# EAGLE design properjack (EAGLE 9.1.1)
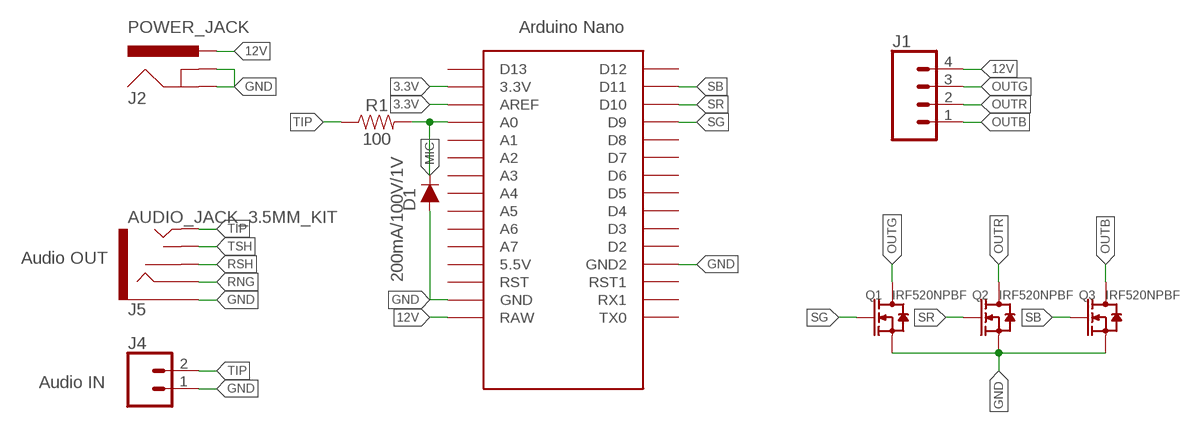
[diagram p0: schematic, sheet 1]

## Parts
D1  200mA/100V/1V  DIODE-1N4148  [DIODE-1N4148]
J1  CONN_04LOCK_LONGPADS  [1X04_LOCK_LONGPADS]
J2  POWER_JACK  [POWER_JACK_PTH]
J4  CONN_02LOCK_LONGPADS  [1X02_LOCK_LONGPADS]
J5  AUDIO_JACK_3.5MM_KIT  [AUDIO-JACK-KIT]
Q1  IRF520NPBF  DIP-MOSFET-N-CH-100V-9.7A-IRF520NPBF(TO-220AB)IRL2703  [TO-220]
Q2  IRF520NPBF  DIP-MOSFET-N-CH-100V-9.7A-IRF520NPBF(TO-220AB)IRL2703  [TO-220]
Q3  IRF520NPBF  DIP-MOSFET-N-CH-100V-9.7A-IRF520NPBF(TO-220AB)IRL2703  [TO-220]
R1  100  100OHM-HORIZ-1/4W-1%  [AXIAL-0.3]
U$1  NANONOICSP  [NANO_2]

## Nets
3.3V: U$1.3.3V U$1.AREF
12V: J1.4 J2.PWR U$1.RAW
GND: D1.A J2.GND J2.GNDBREAK J4.1 J5.SLEEVE Q1.3(S) Q2.3(S) Q3.3(S) U$1.GND U$1.GND1(GND2)
MIC: D1.C R1.P$2 U$1.A0
OUTB: J1.1 Q3.2(D) Q3.HEAT(D)
OUTG: J1.3 Q1.2(D) Q1.HEAT(D)
OUTR: J1.2 Q2.2(D) Q2.HEAT(D)
RNG: J5.RING
RSH: J5.RSH
SB: Q3.1(G) U$1.D11
SG: Q1.1(G) U$1.D9
SR: Q2.1(G) U$1.D10
TIP: J4.2 J5.TIP R1.P$1
TSH: J5.TSH
Unconnected: U$1.5V(5.5V) U$1.A1 U$1.A2 U$1.A3 U$1.A4 U$1.A5 U$1.A6 U$1.A7 U$1.D2 U$1.D3 U$1.D4 U$1.D5 U$1.D6 U$1.D7 U$1.D8 U$1.D12 U$1.D13 U$1.RST U$1.RST1 U$1.RX1 U$1.TX0

## Notes on the sheet
- Audio OUT
- Audio IN

## Library data of the parts
D1 = SparkFun-DiscreteSemi:DIODE: Diode These are standard reverse protection diodes and small signal diodes. SparkFun Products: SparkFun SparkPunk Sound Kit <https://www.sparkfun.com/products/11177> SparkFun ESP8266 Thing <https://www.sparkfun.com/products/13231>; PROD_ID: DIO-08378
J1 = SparkFun-Connectors:CONN_04: Multi connection point. Often used as Generic Header-pin footprint for 0.1 inch spaced/style header connections On any of the 0.1 inch spaced packages, you can populate with these: Break Away Headers - Straight <https://www.sparkfun.com/products/116> (PRT-00116) Break Away Male Headers - Right Angle <https://www.sparkfun.com/products/553> (PRT-00553) Female Headers <https://www.sparkfun.com/products/115> (PRT-00115) Break Away Headers - Machine Pin <https://www.sparkfun.com/products/117> (PRT-00117) Break Away Female Headers - Swiss Machine Pin <https://www.sparkfun.com/products/743> (PRT-00743) For SCREWTERMINALS and SPRING TERMINALS visit here: Screw Terimnals on SparkFun.com <https://www.sparkfun.com/search/results?term=Screw+Terminals> (5mm/3.5mm/2.54mm spacing) This device is also useful as a general connection point to wire up your design to another part of your project. Our various solder wires solder well into these plated through hole pads. Hook-Up Wire - Assortment (Stranded, 22 AWG) <https://www.sparkfun.com/products/11375> (PRT-11375) Hook-Up Wire - Assortment (Solid Core, 22 AWG) <https://www.sparkfun.com/products/11367> (PRT-11367) View the entire wire category on our website here <https://www.sparkfun.com/categories/141> Special notes: Molex polarized connector foot print use with SKU : PRT-08231 with associated crimp pins and housings. 1MM SMD Version SKU: PRT-10208; PROD_ID: CONN-09696
J2 = SparkFun-Connectors:POWER_JACK: Power Jack Connector This is the standard 5.5mm barrel jack for power. The PTH is the most common, proven, reliable, footprint. The Slot footprint only works if the mill layer is transmitted to the PCB fab house so be warned. Here are the connectors we sell at SparkFun: DC Barrel Power Jack/Connector <https://www.sparkfun.com/products/119> (PRT-00119) DC Barrel Power Jack/Connector (SMD) <https://www.sparkfun.com/products/12748> (PRT-12748) DC Barrel Jack Adapter - Breadboard Compatible <https://www.sparkfun.com/products/10811> (PRT-10811) It is used on this SparkFun product (and many, many others): SparkFun RedBoard - Programmed with Arduino <https://www.sparkfun.com/products/12757> (DEV-12757) Also, if you need a mating power supply or connector, please check these out: Wall Adapter Power Supply - 9VDC 650mA <https://www.sparkfun.com/products/298> (TOL-00298) DC Barrel Jack Adapter - Male <https://www.sparkfun.com/products/10287> (PRT-10287); PROD_ID: CONN-08197
J4 = SparkFun-Connectors:CONN_02: Multi connection point. Often used as Generic Header-pin footprint for 0.1 inch spaced/style header connections On any of the 0.1 inch spaced packages, you can populate with these: Break Away Headers - Straight <https://www.sparkfun.com/products/116> (PRT-00116) Break Away Male Headers - Right Angle <https://www.sparkfun.com/products/553> (PRT-00553) Female Headers <https://www.sparkfun.com/products/115> (PRT-00115) Break Away Headers - Machine Pin <https://www.sparkfun.com/products/117> (PRT-00117) Break Away Female Headers - Swiss Machine Pin <https://www.sparkfun.com/products/743> (PRT-00743) For SCREWTERMINALS and SPRING TERMINALS visit here: Screw Terimnals on SparkFun.com <https://www.sparkfun.com/search/results?term=Screw+Terminals> (5mm/3.5mm/2.54mm spacing) This device is also useful as a general connection point to wire up your design to another part of your project. Our various solder wires solder well into these plated through hole pads. Hook-Up Wire - Assortment (Stranded, 22 AWG) <https://www.sparkfun.com/products/11375> (PRT-11375) Hook-Up Wire - Assortment (Solid Core, 22 AWG) <https://www.sparkfun.com/products/11367> (PRT-11367) View the entire wire category on our website here <https://www.sparkfun.com/categories/141> Special notes: Molex polarized connector foot print use with: PRT-08233 with associated crimp pins and housings. 2.54_SCREWTERM for use with PRT-10571. 3.5mm Screw Terminal footprints for PRT-08084 5mm Screw Terminal footprints for use with PRT-08432
J5 = SparkFun-Connectors:AUDIO_JACK_3.5MM: Audio Jack 3.5mm variants of PTH and SMT stereo audio jack with bypass switches. SparkFun Products: SparkFun SparkPunk Sound Kit <[https://www.sparkfun.com/products/11177]> - PTH MP3 Trigger <https://www.sparkfun.com/products/13720> -3.5mm SMD SparkFun PicoBoard <https://www.sparkfun.com/products/11888>- 2.5mm SMD; PROD_ID: CONN-08774; SF_ID: PRT-08032
Q1-Q3 = GerryChen:DIP-MOSFET-N-CH-100V-9.7A-IRF520NPBF(TO-220AB): 305030059
R1 = SparkFun-Resistors:100OHM: 100Ω resistor A resistor is a passive two-terminal electrical component that implements electrical resistance as a circuit element. Resistors act to reduce current flow, and, at the same time, act to lower voltage levels within circuits. - Wikipedia; PROD_ID: RES-12181
U$1 = Arduino-clone:NANO: Arduino Nano

## Board
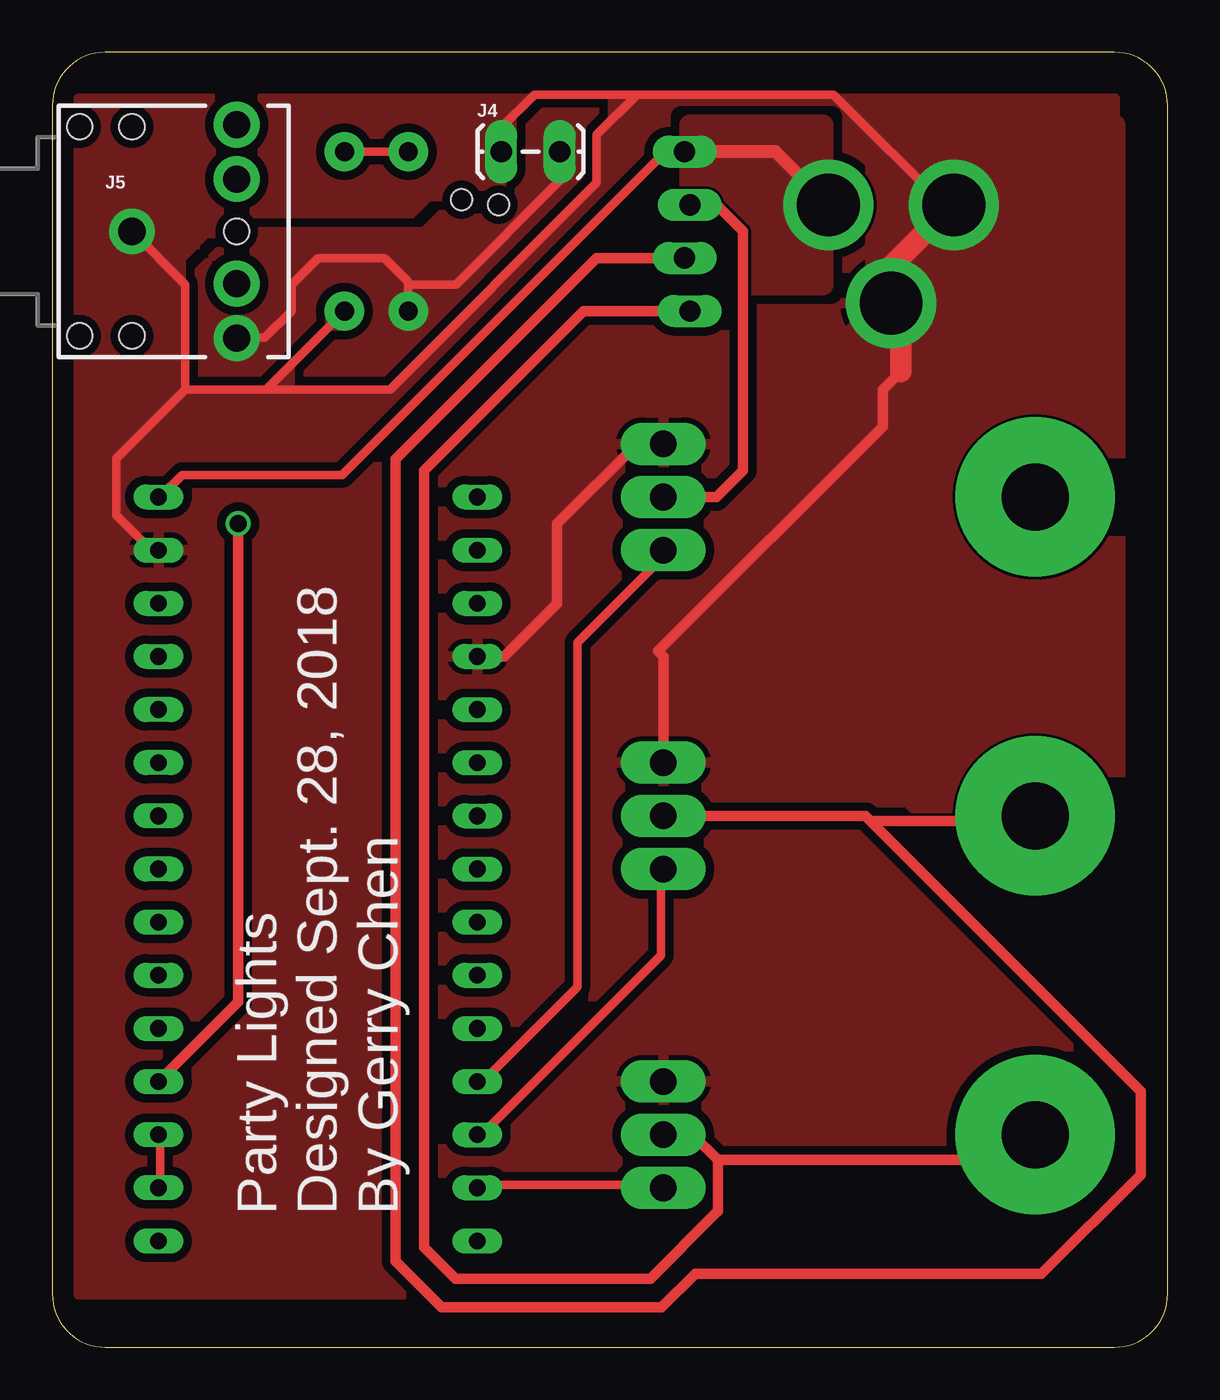
[diagram p1: board, top side]
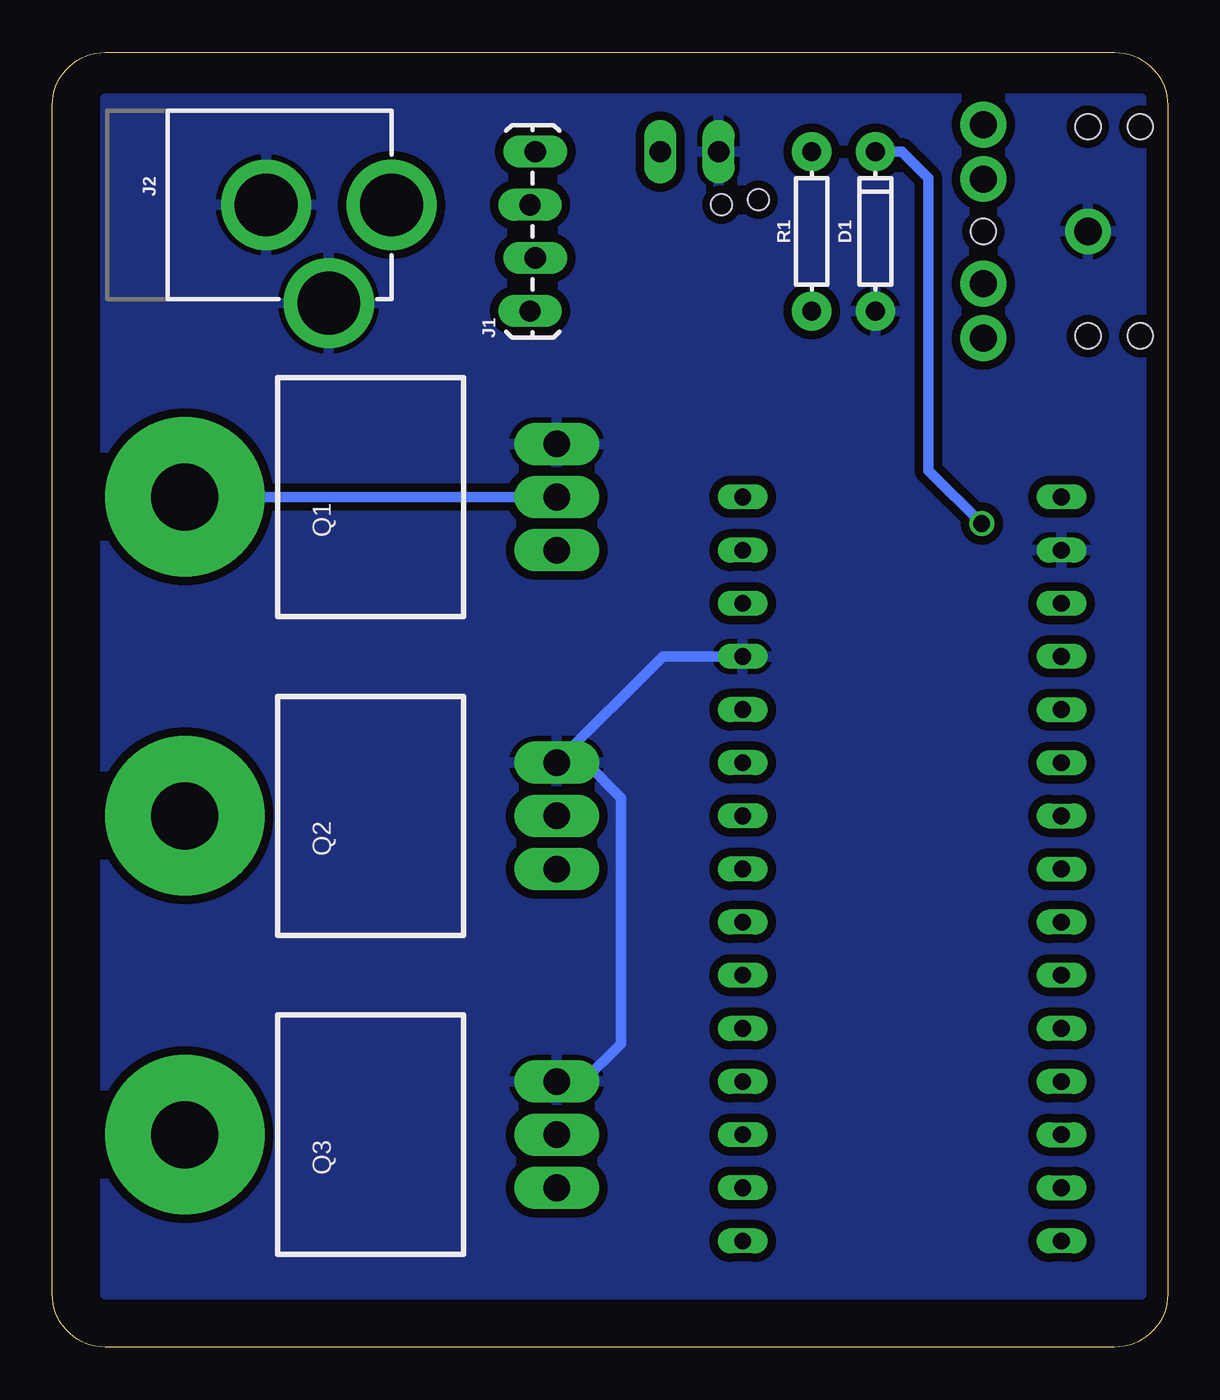
[diagram p2: board, bottom side, seen from below]

Size 53.32 x 61.9 mm. Coordinates in mm from the lower left corner, seen from the top.
Outline: 0,59.36 0,2.54 arc90 2.54,0 50.78,0 arc90 53.32,2.54 53.32,59.36 arc90 50.78,61.9 2.54,61.9 arc90 0,59.36
Copper layers (1*16): Top 0.0356mm / dielectric 1.5011mm / Bottom 0.0356mm
Design rules "gerry-jlcpcb": minimum track width 5mil, minimum drill 13mil, track to track 5mil, track to pad 5mil, pad to pad 5mil, via to via 5mil, smd to smd 5mil, copper to edge 15mil, drill to drill 6mil, minimum pad ring 7mil, minimum via ring 7mil, stop-mask expansion 2.5mil, vias tented up to drill 14mm, thermal gap 10mil
Holes 1 mm at 21.34,54.61 19.56,54.86

### Footprints (pad centres in the part's own frame; a part is rotated, then mirrored left to right if it is on the bottom)
DIODE-1N4148 = drill 0.9 pad 1.88: A -3.81,0; C 3.81,0
1X04_LOCK_LONGPADS = drill 1.016 long: 1 0,0; 2 2.54,-0.254; 3 5.08,0; 4 7.62,-0.254
POWER_JACK_PTH = drill 2.997 pad 4.318: GND 0,7.7; GNDBREAK 4.7,10.7; PWR 0,13.7
1X02_LOCK_LONGPADS = drill 1.016 long: 1 -0.127,0; 2 2.667,0
AUDIO-JACK-KIT = drill 1.3 pad 2.184: RING 5,5.1; RSH 5,2.5; SLEEVE 0,0; TIP 5,-5.1; TSH 5,-2.5 | hole 1.2: 0,5; -2.5,5; -2.5,-5; 0,-5; 5,0
TO-220 = drill 1.27 pad 2.032 long: 1 -2.54,-11.43; 2 0,-11.43; 3 2.54,-11.43 | drill 3.2 pad 7.62: HEAT 0,6.35
AXIAL-0.3 = drill 0.9 pad 1.88: P$1 -3.81,0; P$2 3.81,0
NANO_2 = drill 0.8 long: 3.3V -10.16,24.13; 5V -10.16,-1.27; A0 -10.16,19.05; A1 -10.16,16.51; A2 -10.16,13.97; A3 -10.16,11.43; A4 -10.16,8.89; A5 -10.16,6.35; A6 -10.16,3.81; A7 -10.16,1.27; AREF -10.16,21.59; D2 5.08,1.27; D3 5.08,3.81; D4 5.08,6.35; D5 5.08,8.89; D6 5.08,11.43; D7 5.08,13.97; D8 5.08,16.51; D9 5.08,19.05; D10 5.08,21.59; D11 5.08,24.13; D12 5.08,26.67; D13 -10.16,26.67; GND -10.16,-6.35; GND1 5.08,-1.27; RAW -10.16,-8.89; RST -10.16,-3.81; RST1 5.08,-3.81; RX1 5.08,-6.35; TX0 5.08,-8.89

### Placement (x,y rotation side)
D1  13.97,53.34 90 bottom
J1  30.48,49.53 90 bottom
J2  50.8,54.61 270 bottom
J4  21.59,57.15 0 top
J5  3.81,53.34 0 top
Q1  40.64,40.64 90 bottom
Q2  40.64,25.4 90 bottom
Q3  40.64,10.16 90 bottom
R1  17.02,53.34 90 bottom
U$1  15.24,31.75 180 bottom

### Tracks (layer width: path | path; a pad name or v marks a point on that pad's centre or on a via)
3.3V
  Top 0.406: U$1.3.3V 5.17,7.75 5.17,9.75 U$1.AREF
12V
  Top 0.203: 5.17,40.66 U$1.RAW | J1.4 30.12,57.25
  Top 0.406: 5.17,40.66 6.2,41.7 13.85,41.7 29.4,57.25 30.12,57.25
  Top 0.61: J2.PWR 34.56,57.15 J1.4
  pour Top (no thermals): 36.83,50.8 30.48,50.8 30.48,58.42 36.83,58.42
GND
  Top 0.406: U$1.GND 4.67,38.17 3.04,39.79 3.04,42.48 6.35,45.79 | 42.83,54.39 37.35,59.88 27.94,59.88 | J5.SLEEVE 6.35,50.8 6.35,45.79 | 6.35,45.79 10.23,45.79 | 10.23,45.79 D1.A | 27.94,59.88 23.05,59.88 21.46,58.29 J4.1 | 27.94,59.88 26.02,57.95 26.02,55.66 16.14,45.79 10.23,45.79
  Top 0.508: 40.56,46.64 39.71,45.79 39.71,44.02 28.96,33.27 29.21,33.02 Q2.3 | U$1.GND1 21.59,33.02 24.13,35.56 24.13,39.37 27.94,43.18 Q1.3
  Top 1.016: 41.56,53.12 42.56,54.12 J2.GND | 41.56,53.12 42.83,54.39 | 40.56,46.64 40.56,49.34 J2.GNDBREAK 40.1,51.66 41.56,53.12
  Bottom 0.508: U$1.GND1 24.13,33.02 Q2.3 27.82,27.94 26.13,26.25 26.13,14.51 27.94,12.7 Q3.3
  pour Top (no thermals): 39.37,58.42 50.8,58.42 50.8,16.51 35.56,31.75 35.56,45.72 39.37,49.53
  pour Top (isolate 0.406, rank 6, no thermals): 2.54,54.61 7.62,59.69 22.86,59.69 22.86,52.07 13.97,43.18 2.54,43.18
  pour Bottom (isolate 0.406, rank 6): 1.27,59.69 50.8,59.69 50.8,2.54 1.27,2.54
  pour Top (isolate 0.406, rank 6): 1.27,59.69 50.8,59.69 50.8,2.54 1.27,2.54
MIC  (via drill 0.8)
  Top 0.406: R1.P$2 D1.C
  Top 0.508: U$1.A0 8.89,16.51 v8.89,39.37
  Bottom 0.508: v8.89,39.37 11.43,41.91 11.43,55.88 12.7,57.15 D1.C
OUTB
  Top 0.508: J1.1 25.4,49.53 17.78,41.91 17.78,4.78 19.28,3.28 28.59,3.28 31.7,6.39 31.81,6.5 31.81,8.95 | Q3.2 30.61,10.16 31.81,8.95 | 31.81,8.95 45.78,8.95 Q3.HEAT
OUTG
  Top 0.508: 33.02,48.26 33.02,53.34 31.75,54.61 J1.3 | 33.02,48.26 | Q1.2 31.75,40.64 33.02,41.91 33.02,48.26
  Bottom 0.508: Q1.2 Q1.HEAT
OUTR
  Top 0.508: 39.12,25.15 52.03,12.24 52.03,8.25 47.29,3.51 30.74,3.51 29.13,1.9 18.61,1.9 16.4,4.11 16.4,42.45 26.02,52.07 J1.2 | Q2.2 38.87,25.4 39.12,25.15 | 39.12,25.15 46.74,25.15 Q2.HEAT
SB
  Top 0.406: U$1.D11 20.62,7.75 29.1,7.75 Q3.1
SG
  Top 0.406: U$1.D9 20.62,12.74 25.11,17.23 25.11,33.68 29.1,37.67 Q1.1
SR
  Top 0.406: U$1.D10 20.62,10.24 29.1,18.72 29.1,22.75 Q2.1
TIP
  Top 0.406: J5.TIP 8.83,48.26 10.16,48.26 11.43,49.53 11.43,50.8 12.7,52.07 15.88,52.07 17.02,50.93 17.02,50.8 | 17.02,50.8 R1.P$1 | J4.2 24.26,55.75 19.3,50.8 17.02,50.8
  pour Top (isolate 0.406, no thermals): 26.67,59.69 26.67,55.88 16.51,45.72 6.35,45.72 6.35,50.8 8.89,53.34 17.78,53.34 24.13,59.69

### Text on the board
tPlace: Party Lights / Designed Sept. 28, 2018 / By Gerry Chen